# EAGLE design WebServer3_shield_wSD_FTDI (EAGLE 6.1)
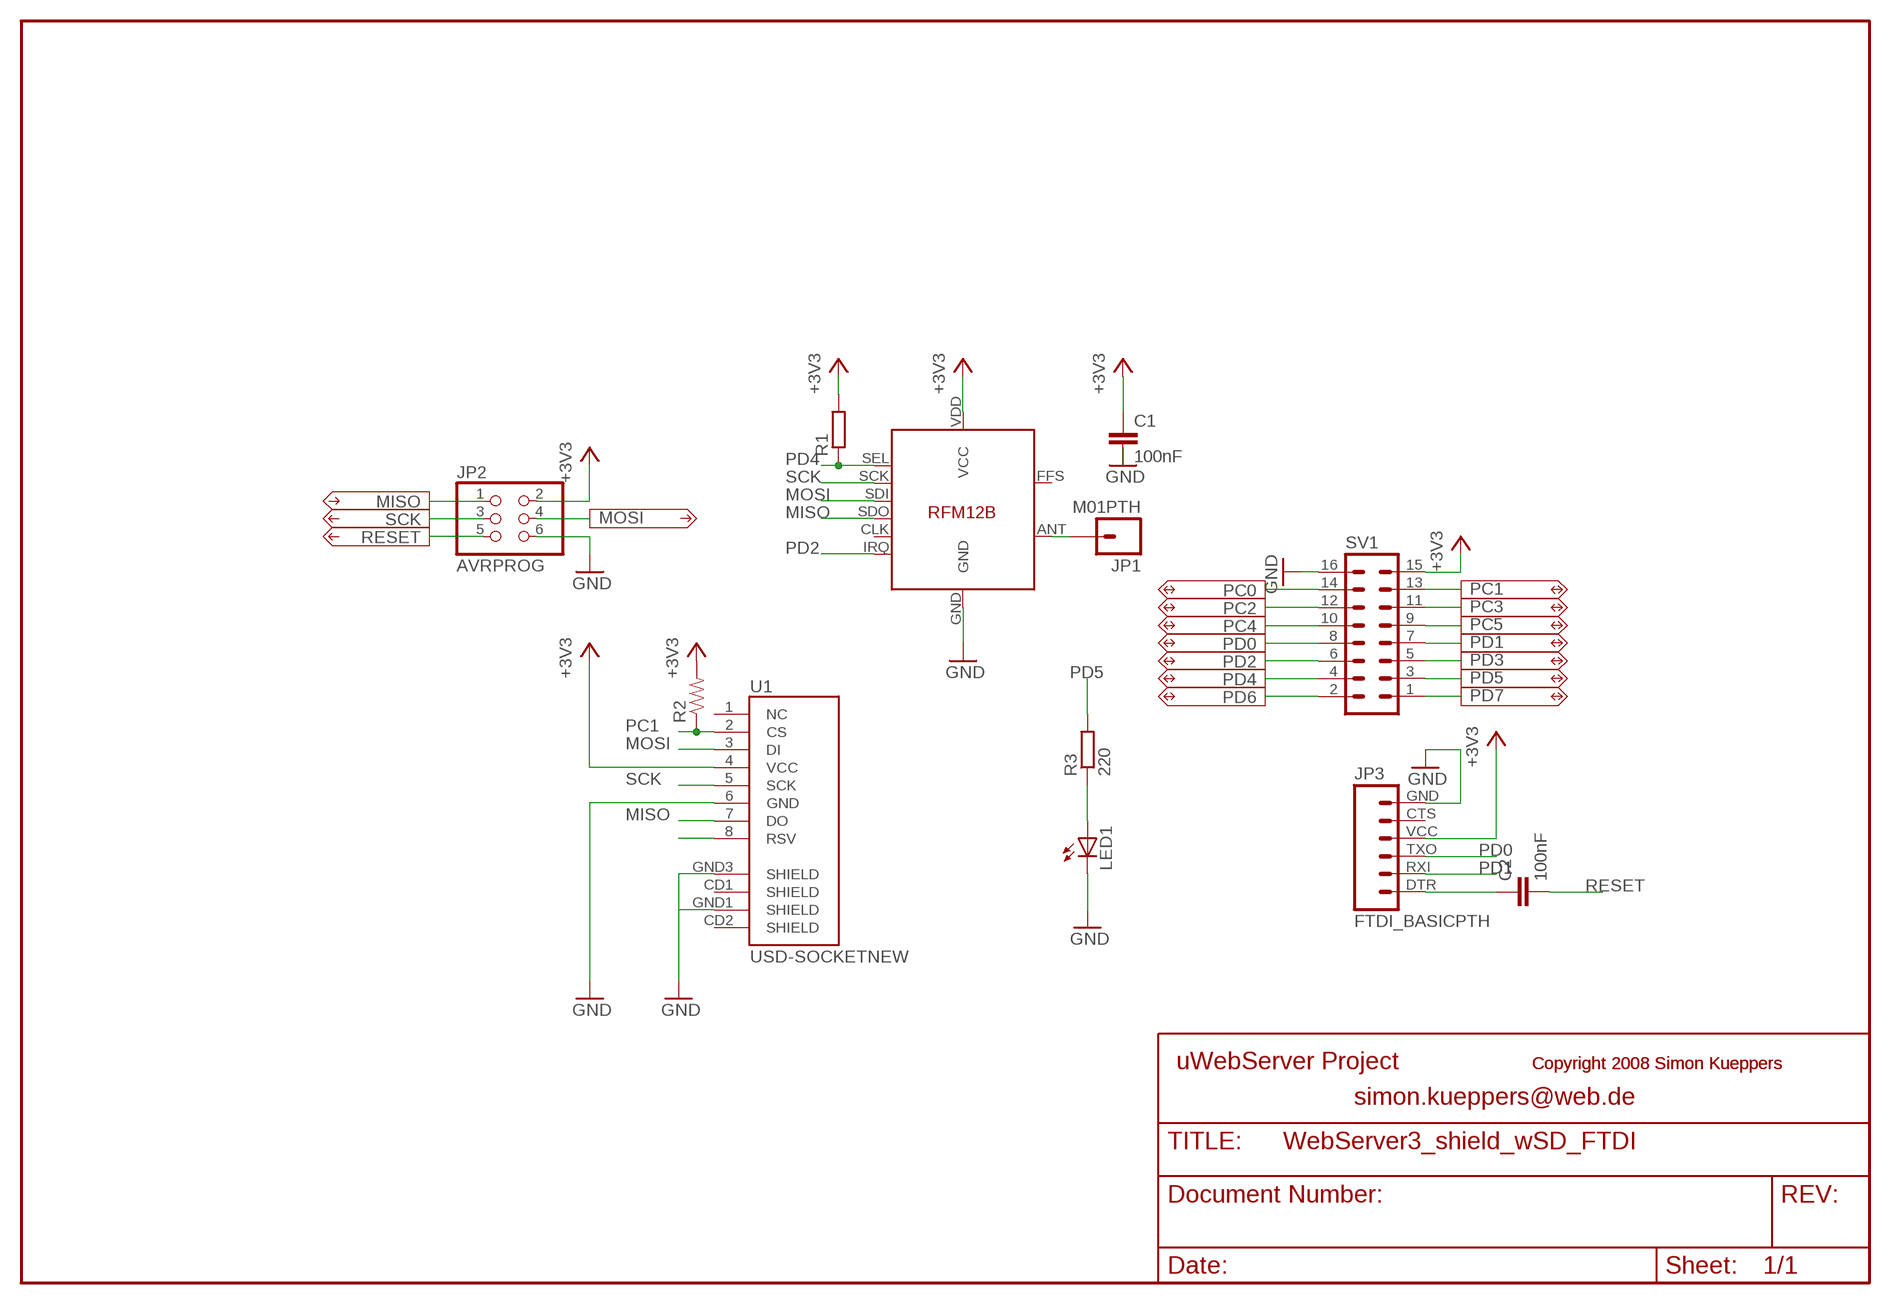
[diagram p0: schematic, sheet 1]

## Parts
C1  100nF  C-EUC0805  [C0805]
C2  100nF  C-EUC0805  [C0805]
JP1  M01PTH  [1X01]
JP2  AVRPROG  PINHD-2X3_2.54  [2X03]
JP3  FTDI_BASICPTH  [FTDI_BASIC]
LED1  LED0603  [LED-0603]
R1  R-EU_R0805  [R0805]
R2  RESISTOR0805-RES  [0805]
R3  220  R-EU_R0805  [R0805]
RFM12B  RFM12B  [RFM12B]
SV1  MA08-2  [MA08-2]
U1  USD-SOCKETNEW  [MICRO-SD-SOCKET-PP]

## Nets
+3V3 [power]: C1.1 JP2.2 JP3.VCC R1.2 R2.2 RFM12B.VDD(VCC) SV1.15 U1.4(VCC)
GND [power]: C1.2 JP2.6 JP3.GND LED1.C RFM12B.GND SV1.16 U1.6(GND) U1.GND3(SHIELD)
MISO: JP2.1 RFM12B.SDO U1.7(DO)
MOSI: JP2.4 RFM12B.SDI U1.3(DI)
N$1: LED1.A R3.1
N$3: JP1.1 RFM12B.ANT
N$6: C2.1 JP3.DTR
N$8: U1.8(RSV)
N$10: U1.GND1(SHIELD)
PC0: SV1.14
PC1: R2.1 SV1.13 U1.2(CS)
PC2: SV1.12
PC3: SV1.11
PC4: SV1.10
PC5: SV1.9
PD0: JP3.TXO SV1.8
PD1: JP3.RXI SV1.7
PD2: RFM12B.IRQ SV1.6
PD3: SV1.5
PD4: R1.1 RFM12B.SEL SV1.4
PD5: R3.2 SV1.3
PD6: SV1.2
PD7: SV1.1
RESET: C2.2 JP2.5
SCK: JP2.3 RFM12B.SCK U1.5(SCK)
Unconnected: JP3.CTS RFM12B.CLK RFM12B.FFS U1.1(NC) U1.CD1(SHIELD) U1.CD2(SHIELD)

## Notes on the sheet
- uWebServer Project | Copyright 2008 Simon Kueppers | Copyright 2008 Simon Kueppers
- simon.kueppers@web.de

## Library data of the parts
C1 C2 = rcl:C-EU: CAPACITOR, European symbol
JP1 = SparkFun:M01: Header 1 Standard 1-pin 0.1" header. Use with straight break away headers (SKU : PRT-00116), right angle break away headers (PRT-00553), swiss pins (PRT-00743), machine pins (PRT-00117), and female headers (PRT-00115).
JP2 = pinhead:PINHD-2X3: PIN HEADER
JP3 = SparkFun:FTDI_BASIC: FTDI Basic: 3.3V and 5V
LED1 = SparkFun:LED: LEDs Standard schematic elements and footprints for 5mm, 3mm, 1206, and 0603 sized LEDs. 5mm - Spark Fun Electronics SKU : COM-00529 (and others)
R1 R3 = rcl:R-EU_: RESISTOR, European symbol
R2 = SparkFun:RESISTOR: Resistor Basic schematic elements and footprints for 0603, 1206, and PTH resistors.
RFM12B = JeeParts:RFM12B
SV1 = con-lstb:MA08-2: PIN HEADER; OC_FARNELL: unknown; OC_NEWARK: unknown
U1 = SparkFun:USD-SOCKET: microSD Socket Push-push type uSD socket. Schematic element and footprint production proven. Spark Fun Electronics SKU : PRT-00127. tDoc lines correctly indicate media card edge positions when inserting (unlocked, locked, depressed).

## Net classes
0 default: width 0.254 mm, drill 0.254 mm, clearance 0.254 mm
1 power: width 0.305 mm, drill 0.305 mm, clearance 0.305 mm

## Board
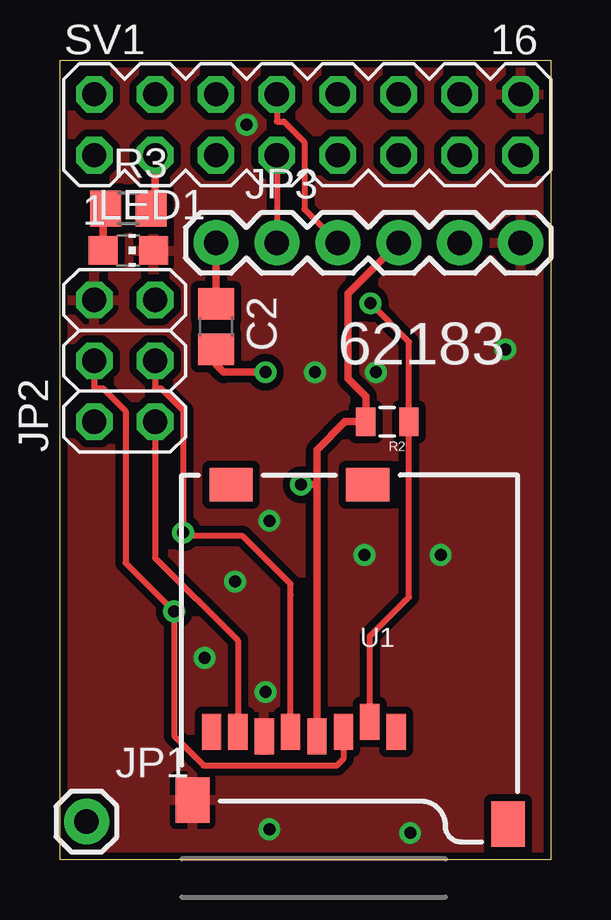
[diagram p1: board, top side]
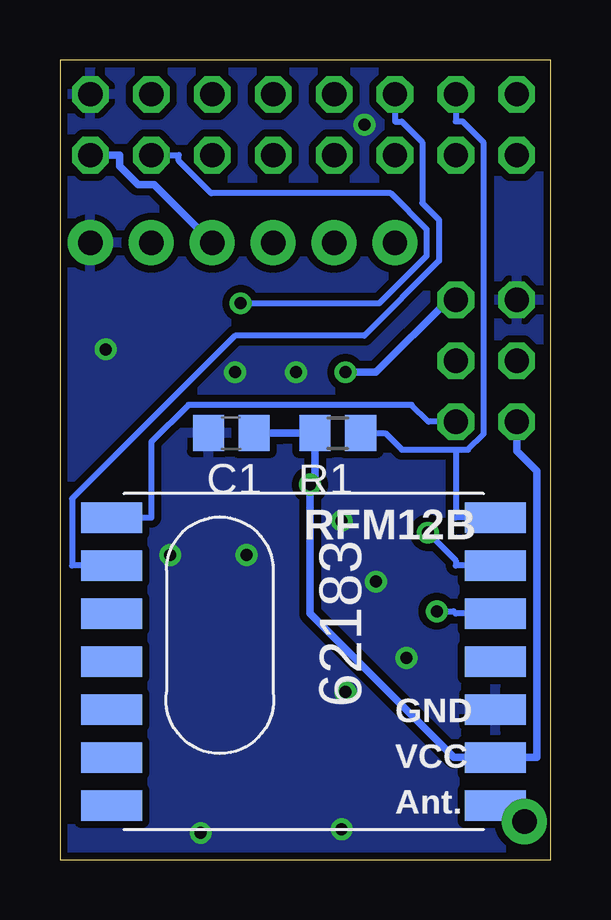
[diagram p2: board, bottom side, seen from below]

Size 20.48 x 33.34 mm. Coordinates in mm from the lower left corner, seen from the top.
Outline: 0,0 0,33.34 20.48,33.34 20.48,0 0,0
Copper layers (1*16): Top 0.035mm / dielectric 1.5mm / Bottom 0.035mm
Design rules: minimum track width 10mil, minimum drill 0.5mm, track to track 10mil, track to pad 10mil, pad to pad 10mil, via to via 10mil, smd to smd 10mil, copper to edge 10mil, drill to drill 10mil, minimum pad ring 10mil, minimum via ring 8mil, stop-mask expansion 4mil, vias tented up to drill 0mil, thermal gap 10mil

### Footprints (pad centres in the part's own frame; a part is rotated, then mirrored left to right if it is on the bottom)
C0805 = smd 1.3 x 1.5: 1 -0.95,0; 2 0.95,0
1X01 = drill 1.016 pad 1.88: 1 0,0
2X03 = drill 1.016 octagon: 1 -2.54,-1.27; 2 -2.54,1.27; 3 0,-1.27; 4 0,1.27; 5 2.54,-1.27; 6 2.54,1.27
FTDI_BASIC = drill 1.016 pad 1.88: CTS 10.16,0; DTR 0,0; GND 12.7,0; RXI 2.54,0; TXO 5.08,0; VCC 7.62,0
CHIP-LED0805 = smd 1.2 x 1.2: A 0,-1.05; C 0,1.05
R0805 = smd 1.3 x 1.5: 1 -0.95,0; 2 0.95,0
0805 = smd 0.8 x 1.2: 1 -0.9,0; 2 0.9,0
RFM12B = smd 2.54 x 1.27: ANT 8,-6; CLK -8,-2; FFS -8,2; GND 8,-2; IRQ -8,4; P$8 -8,0; P$10 -8,-4; P$12 -8,-6; P$16 8,0; SCK 8,4; SDI 8,2; SDO -8,6; SEL 8,6; VDD 8,-4
MA08-2 = drill 1.016 octagon: 1 -8.89,-1.27; 2 -8.89,1.27; 3 -6.35,-1.27; 4 -6.35,1.27; 5 -3.81,-1.27; 6 -3.81,1.27; 7 -1.27,-1.27; 8 -1.27,1.27; 9 1.27,-1.27; 10 1.27,1.27; 11 3.81,-1.27; 12 3.81,1.27; 13 6.35,-1.27; 14 6.35,1.27; 15 8.89,-1.27; 16 8.89,1.27
MICRO-SD-SOCKET-PP = smd 0.8 x 1.5: 1 -8.94,10.7; 2 -7.84,10.3; 3 -6.74,10.7; 4 -5.64,10.9; 5 -4.54,10.7; 6 -3.44,10.9; 7 -2.34,10.7; 8 -1.24,10.7 | smd 1.8 x 1.4: CD1 -2.05,0.4; CD2 -7.75,0.4 | smd 1.4 x 1.9: GND1 -13.6,14.55; GND3 -0.45,13.55

### Placement (x,y rotation side)
C1  13.34,17.78 180 bottom
C2  6.51,22.22 270 top
JP1  1.11,1.59 0 top
JP2  2.7,20.8 90 top
JP3  6.51,25.72 0 top
LED1  [CHIP-LED0805]  2.86,25.4 270 top
R1  8.89,17.78 180 bottom
R2  13.65,18.26 180 top
R3  2.86,27.15 0 top
RFM12B  10.32,8.25 0 bottom
SV1  10.32,30.64 0 top
U1  5.08,16.03 180 top

### Tracks (layer width: path | path; a pad name or v marks a point on that pad's centre or on a via)
+3V3  (via drill 0.5 pad 0.91)
  Top 0.305: JP3.VCC 12.01,23.6 12.01,20.05 12.75,19.31 R2.2 11.89,18.26 10.72,17.08 10.72,15.64 | 10.72,15.64 v10.05,15.64 | U1.4 10.72,15.64
  Bottom 0.305: JP2.2 1.43,17.04 0.59,16.2 0.59,4.25 1.46,4.25 RFM12B.VDD 4.05,4.25 10.05,10.26 v10.05,15.64 9.84,15.85 R1.2 11.28,17.78 | JP3.VCC 16.56,28.15 17.23,28.15 17.99,28.91 17.99,29.37 SV1.15 | C1.1 11.28,17.78 | 11.28,17.78
GND  (via drill 0.5 pad 0.91)
  other vias: 12.7,12.7 6.03,8.41 8.57,6.98 10.64,20.32 15.88,12.7 18.57,21.27 13.18,20.32 8.73,14.13 7.3,11.59 8.73,1.27 14.61,1.11 7.78,30.64
  pour Top (isolate 0.305): 0,33.34 0,0 21.11,0 21.11,33.34
  pour Bottom (isolate 0.305): 0,0 0,33.34 20.95,33.34 21.11,0
MISO
  Top 0.254: U1.7 7.42,9.13 3.97,12.58 3.97,17.11 JP2.1
  Bottom 0.254: RFM12B.SDO 16.67,14.25 16.67,17.42 15.12,18.96 5.82,18.96 5.11,18.26 JP2.1
MOSI  (via drill 0.5 pad 0.91)
  Top 0.254: JP2.4 1.43,19.65 1.78,19.65 2.73,18.7 2.73,12.38 v4.76,10.35 4.76,5.15 5.99,3.93 11.55,3.93 11.82,4.2 U1.3
  Bottom 0.254: RFM12B.SDI 3.97,10.25 4.07,10.35 v4.76,10.35
N$1
  Top 0.305: LED1.A 1.81,27.05 R3.1
N$3
  Bottom 0.254: RFM12B.ANT 1.78,2.25 JP1.1
N$6
  Top 0.305: JP3.DTR C2.1 | C2.1 | C2.1 | C2.1
PC1  (via drill 0.5 pad 0.91)
  Top 0.254: v12.95,23.19 14.55,21.59 R2.1 14.55,10.95 12.92,9.32 U1.2
  Bottom 0.254: SV1.13 15.53,29.37 15.53,29.13 14.17,27.78 6.68,27.78 5.18,26.27 5.18,25.18 7.16,23.19 v12.95,23.19
PD0
  Top 0.254: SV1.8 9.05,30.77 9.34,30.77 10.19,29.91 10.19,27.11 JP3.TXO
PD1
  Top 0.254: SV1.7 JP3.RXI
PD2
  Bottom 0.254: RFM12B.IRQ 19.97,12.25 19.97,15.05 13.17,21.85 7.79,21.85 4.67,24.97 4.67,26.68 5.37,27.37 5.37,29.91 6.22,30.77 6.51,30.77 SV1.6
PD4
  Bottom 0.254: 3.97,17.09 3.46,17.09 2.81,17.75 2.81,29.89 3.68,30.77 3.97,30.77 SV1.4 | 3.97,17.09 6.22,17.09 6.91,17.78 R1.1 | 3.97,17.09 3.97,14.25 RFM12B.SEL
PD5
  Top 0.305: SV1.3 3.97,27.31 R3.2
RESET  (via drill 0.5 pad 0.91)
  Top 0.305: v8.57,20.32 6.83,20.32 6.51,20.64 C2.2
  Bottom 0.305: JP2.5 4.29,23.34 7.3,20.32 v8.57,20.32
SCK  (via drill 0.5 pad 0.91)
  Top 0.254: U1.5 9.62,11.05 9.62,11.49 7.62,13.49 5.24,13.49 | JP2.3 3.97,19.65 4.21,19.65 5.14,18.72 v5.14,13.63 5.14,13.6 5.24,13.49 | 5.24,13.49 5.08,13.65 5.24,13.49
  Bottom 0.254: RFM12B.SCK 3.97,12.25 3.97,12.47 v5.14,13.63

### Text on the board
tPlace: 62183
bPlace: 62183